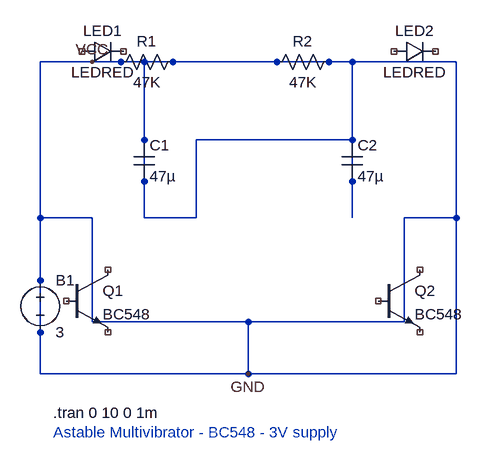
[diagram p0: schematic 10-dual-led-flasher_generated-by-claude-sonnet-4-6.asc]
10-dual-led-flasher_generated-by-claude-sonnet-4-6.asc, the LTspice schematic file:
Version 4
SHEET 1 880 680
WIRE 80 80 80 160
WIRE 80 80 160 80
WIRE 160 80 320 80
WIRE 320 80 480 80
WIRE 480 80 640 80
WIRE 640 80 720 80
WIRE 720 80 720 160
WIRE 720 160 720 240
WIRE 80 160 80 240
WIRE 80 240 80 320
WIRE 720 240 720 320
WIRE 80 320 160 320
WIRE 720 320 640 320
WIRE 160 320 160 400
WIRE 640 320 640 400
WIRE 160 400 160 480
WIRE 640 400 640 480
WIRE 160 480 400 480
WIRE 400 480 640 480
WIRE 400 480 400 560
WIRE 400 560 80 560
WIRE 400 560 720 560
WIRE 80 560 80 320
WIRE 720 560 720 320
WIRE 240 80 240 200
WIRE 240 200 240 320
WIRE 560 80 560 200
WIRE 560 200 560 320
WIRE 240 320 320 320
WIRE 320 320 320 200
WIRE 320 200 560 200
FLAG 400 560 GND
FLAG 160 80 VCC
SYMBOL voltage 80 400 R0
SYMATTR InstName B1
SYMATTR Value 3
SYMBOL npn 120 400 R0
SYMATTR InstName Q1
SYMATTR Value BC548
SYMBOL npn 600 400 R0
SYMATTR InstName Q2
SYMATTR Value BC548
SYMBOL res 300 64 R90
WINDOW 0 0 56 VBottom 2
WINDOW 3 32 56 VTop 2
SYMATTR InstName R1
SYMATTR Value 47K
SYMBOL res 540 64 R90
WINDOW 0 0 56 VBottom 2
WINDOW 3 32 56 VTop 2
SYMATTR InstName R2
SYMATTR Value 47K
SYMBOL cap 224 200 R0
SYMATTR InstName C1
SYMATTR Value 47µ
SYMATTR SpiceLine Rser=0 Cpar=0
SYMBOL cap 544 200 R0
SYMATTR InstName C2
SYMATTR Value 47µ
SYMATTR SpiceLine Rser=0 Cpar=0
SYMBOL diode 144 80 R270
WINDOW 0 32 32 VTop 2
WINDOW 3 0 32 VBottom 2
SYMATTR InstName LED1
SYMATTR Value LEDRED
SYMBOL diode 624 80 R270
WINDOW 0 32 32 VTop 2
WINDOW 3 0 32 VBottom 2
SYMATTR InstName LED2
SYMATTR Value LEDRED
TEXT 100 620 Left 2 !.tran 0 10 0 1m
TEXT 100 650 Left 2 ;Astable Multivibrator - BC548 - 3V supply

The netlist it stands for:
* 10-dual-led-flasher_generated-by-claude-sonnet-4-6.asc
V§B1 VCC VCC 3
Q1 NC_01 NC_02 NC_03 0 BC548
Q2 NC_04 NC_05 NC_06 0 BC548
R1 VCC VCC 47K
R2 VCC VCC 47K
C1 VCC VCC 47µ Rser=0 Cpar=0
C2 VCC VCC 47µ Rser=0 Cpar=0
D§LED1 NC_07 NC_08 LEDRED
D§LED2 NC_09 NC_10 LEDRED
.model D D
.lib standard.dio
.model NPN NPN
.model PNP PNP
.lib standard.bjt
.tran 0 10 0 1m
* Astable Multivibrator - BC548 - 3V supply
.backanno
.end